# EAGLE design rgbBreakoutBoard (EAGLE 7.7.0)
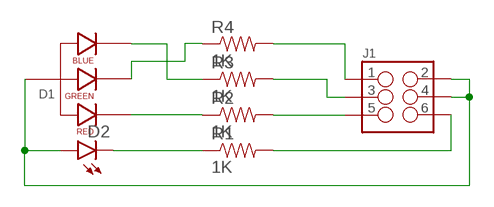
[diagram p0: schematic, sheet 1]

## Parts
D1  LED-RGB-CA-THRUCLEAR  [LED-RGB-THRU]
D2  LED5MM  [LED5MM]
J1  M03X2SMT  [2X3_SMT_POSTS]
R1  1K  1MOHM-1/10W-1%(0603)  [0603-RES]
R2  1K  1MOHM-1/10W-1%(0603)  [0603-RES]
R3  1K  1MOHM-1/10W-1%(0603)  [0603-RES]
R4  1K  1MOHM-1/10W-1%(0603)  [0603-RES]

## Nets
N$1: D2.K(C) R1.1
N$2: D1.1(RED_CATHODE) R2.1
N$3: D1.4(BLUE_CATHODE) R3.1
N$4: D1.3(GREEN_CATHODE) R4.1
N$5: D1.2(ANODE) D2.A J1.2 J1.4
N$6: J1.1 R4.2
N$7: J1.3 R3.2
N$8: J1.5 R2.2
N$9: J1.6 R1.2

## Library data of the parts
D1 = SparkFun-LED:LED-RGB-CA-THRU: RGB Through-hole common anode SparkFun store front COM-10821 (diffuse) COM-10820 (clear); PROD_ID: DIO-10631
D2 = SparkFun-LED:LED: LEDs Standard schematic elements and footprints for 5mm, 3mm, 1206, and 0603 sized LEDs. 5mm - Spark Fun Electronics SKU : COM-00529 (and others)
J1 = SparkFun-Connectors:M03X2: 2x3 .1" header. Shrouded, with keying- CONN-10681 SMT- CONN-11415 Pogo pins- HW-11044; PROD_ID: CONN-11415
R1-R4 = SparkFun-Resistors:1MOHM-1/10W-1%(0603): RES-07868; PROD_ID: RES-07868; VALUE: 1M

## Board
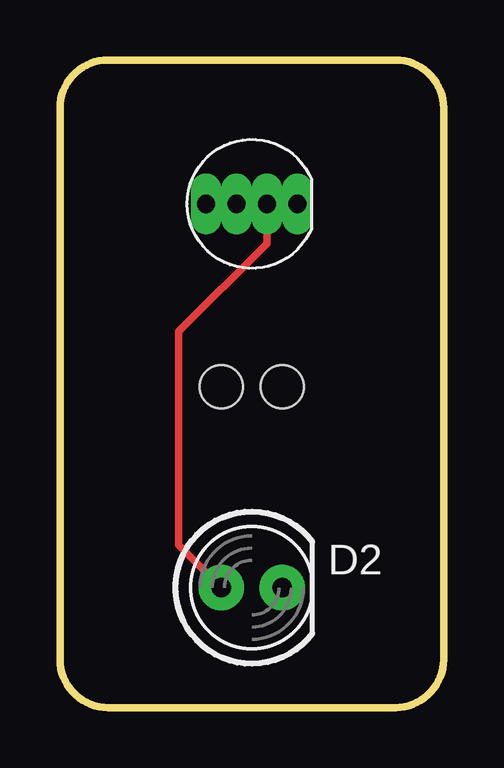
[diagram p1: board, top side]
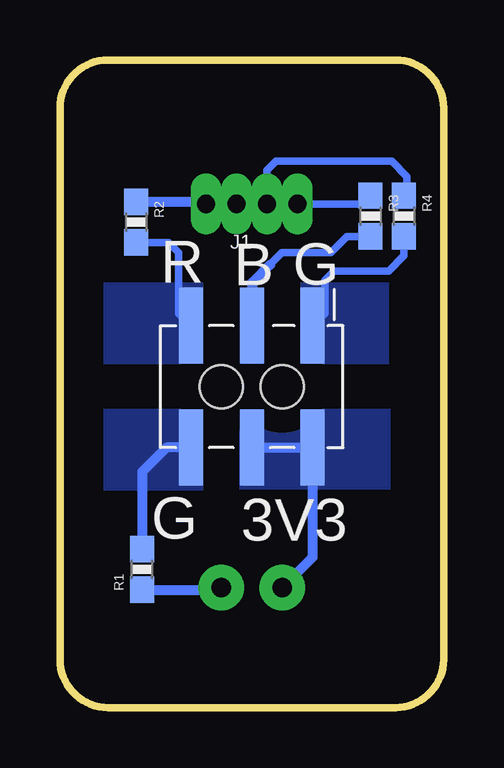
[diagram p2: board, bottom side, seen from below]

Size 16 x 27 mm. Coordinates in mm from the lower left corner, seen from the top.
Outline: 2,27 14,27 arc-90 16,25 16,2 arc-90 14,0 2,0 arc-90 0,2 0,25 arc-90 2,27
Copper layers (1*16): Top 0.035mm / dielectric 1.5mm / Bottom 0.035mm
Design rules "default": minimum track width 10mil, minimum drill 24mil, track to track 8mil, track to pad 8mil, pad to pad 8mil, via to via 8mil, smd to smd 8mil, copper to edge 40mil, drill to drill 8mil, minimum pad ring 10mil, minimum via ring 8mil, stop-mask expansion 4mil, vias tented up to drill 0mil, thermal gap 10mil

### Footprints (pad centres in the part's own frame; a part is rotated, then mirrored left to right if it is on the bottom)
LED-RGB-THRU = drill 0.762 pad 0.889 long: 1 1.905,0; 2 0.635,0; 3 -0.635,0; 4 -1.905,0
LED5MM = drill 0.813 pad 1.88: A -1.27,0; K 1.27,0
2X3_SMT_POSTS = smd 1 x 3.17: 1 -2.54,-2.54; 2 -2.54,2.54; 3 0,-2.54; 4 0,2.54; 5 2.54,-2.54; 6 2.54,2.54 | hole 1.8: -1.27,0; 1.27,0
0603-RES = smd 1.1 x 1: 1 -0.85,0; 2 0.85,0

### Placement (x,y rotation side)
D1  8,21 0 top
D2  8,5 0 top
J1  8,13.38 180 bottom
R1  12.57,5.76 90 bottom
R2  12.83,20.24 270 bottom
R3  3.05,20.49 270 bottom
R4  1.65,20.49 270 bottom

### Tracks (layer width: path | path; a pad name or v marks a point on that pad's centre or on a via)
N$1
  Bottom 0.406: R1.1 9.36,4.91 D2.K
N$2
  Bottom 0.406: R2.1 10,21.09 D1.1
N$3
  Bottom 0.305: D1.4 3.39,21 R3.1
N$4
  Bottom 0.305: D1.3 7.37,22.4 6.98,22.78 2.16,22.78 1.52,22.14 1.52,21.47 R4.1
N$5
  Top 0.305: D1.2 8.63,19.35 4.95,15.67 4.95,6.78 D2.A
  Bottom 0.406: J1.4 J1.2 5.46,6.27 D2.A
  pour Bottom (no thermals): 2.23,12.42 5.76,12.42 8.51,12.4 8.51,9.12 5.71,9.11 2.23,9.11
N$6
  Bottom 0.305: R4.2 1.65,18.84 2.29,18.21 4.57,18.21 4.95,17.83 4.95,16.43 J1.1
  pour Bottom (no thermals): 2.28,17.7 5.97,17.7 5.97,14.34 2.28,14.34
N$7
  Bottom 0.305: R3.2 4.02,19.64 4.7,18.97 6.73,18.97 7.24,18.46
  Bottom 0.406: 7.24,18.46 8,17.7 J1.3
N$8
  Bottom 0.305: R2.2 11.47,19.39 11.05,18.97 11.05,16.43 J1.5
  pour Bottom (no thermals): 10.03,17.7 14.17,17.7 14.17,14.34 10.03,14.34
N$9
  Bottom 0.406: J1.6 11.56,10.84 12.57,9.83 R1.2
  pour Bottom (no thermals): 10.03,12.42 14.17,12.42 14.17,9.06 10.03,9.06

### Text on the board
bPlace: G | B | R | 3V3 | G